# Altium schematic sheet Input.SchDoc: Inputs
size A4; Engineer: CT; SheetNumber: 5; SheetTotal: 5
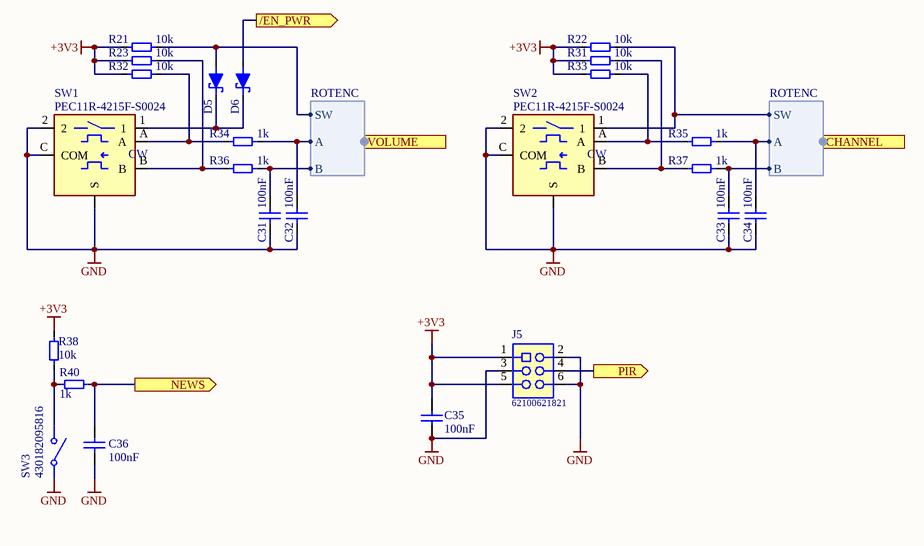
[diagram p0: Input.SchDoc]

## Parts
C31  value 100nF  [0603-C-N]  (hidden comment: Capacitor 100nF +/-10% 50V X7R 0603)
C32  value 100nF  [0603-C-N]  (hidden comment: Capacitor 100nF +/-10% 50V X7R 0603)
C33  value 100nF  [0603-C-N]  (hidden comment: Capacitor 100nF +/-10% 50V X7R 0603)
C34  value 100nF  [0603-C-N]  (hidden comment: Capacitor 100nF +/-10% 50V X7R 0603)
C35  value 100nF  [0603-C-N]  (hidden comment: Capacitor 100nF +/-10% 50V X7R 0603)
C36  value 100nF  [0603-C-N]  (hidden comment: Capacitor 100nF +/-10% 50V X7R 0603)
D5  1PS79SB30,115  [FP-SOD523-MFG]  (value not drawn)
D6  1PS79SB30,115  [FP-SOD523-MFG]  (value not drawn)
J5  62100621821  [62100621821]
R21  value 10k  [0603-R-N]  (hidden comment: Resistor 10k +/-1% 50V 0603)
R22  value 10k  [0603-R-N]  (hidden comment: Resistor 10k +/-1% 50V 0603)
R23  value 10k  [0603-R-N]  (hidden comment: Resistor 10k +/-1% 50V 0603)
R31  value 10k  [0603-R-N]  (hidden comment: Resistor 10k +/-1% 50V 0603)
R32  value 10k  [0603-R-N]  (hidden comment: Resistor 10k +/-1% 50V 0603)
R33  value 10k  [0603-R-N]  (hidden comment: Resistor 10k +/-1% 50V 0603)
R34  value 1k  [0603-R-N]  (hidden comment: Resistor 1k +/-1% 50V 0603)
R35  value 1k  [0603-R-N]  (hidden comment: Resistor 1k +/-1% 50V 0603)
R36  value 1k  [0603-R-N]  (hidden comment: Resistor 1k +/-1% 50V 0603)
R37  value 1k  [0603-R-N]  (hidden comment: Resistor 1k +/-1% 50V 0603)
R38  value 10k  [0603-R-N]  (hidden comment: Resistor 10k +/-1% 50V 0603)
R40  value 1k  [0603-R-N]  (hidden comment: Resistor 1k +/-1% 50V 0603)
SW1  PEC11R-4215F-S0024  [PEC11R-4215F-S0024]
SW2  PEC11R-4215F-S0024  [PEC11R-4215F-S0024]
SW3  430182095816  [WS-TASV_L6W6H9.5_4301x20958x6]

## Ports
/EN_PWR (out), CHANNEL (harness ROTENC), NEWS (out), PIR (out), VOLUME (harness ROTENC)

## Harnesses
ROTENC: SW, A, B

## Nets
+3V3: C35.2 J5.1 J5.5 R21.1 R22.1 R23.2 R31.2 R32.2 R33.2 R38.2
GND: C31.1 C32.1 C33.1 C34.1 C35.1 C36.1 J5.2 J5.3 J5.6 SW1.2 SW1.C(COM) SW1.S SW2.2 SW2.C(COM) SW2.S SW3.1
/EN_PWR: D6.2(A) ; port /EN_PWR
NEWS: C36.2 R40.2 ; port NEWS
PIR: J5.4 ; port PIR
NetC31_2: C31.2 R36.2 ; port VOLUME.B
NetC32_2: C32.2 R34.2 ; port VOLUME.A
NetC33_2: C33.2 R37.2 ; port CHANNEL.B
NetC34_2: C34.2 R35.2 ; port CHANNEL.A
NetD5_1: D5.1(K) D6.1(K) SW1.1
NetD5_2: D5.2(A) R21.2 ; port VOLUME.SW
NetR22_2: R22.2 SW2.1 ; port CHANNEL.SW
NetR23_1: R23.1 R36.1 SW1.B
NetR31_1: R31.1 R37.1 SW2.B
NetR32_1: R32.1 R34.1 SW1.A
NetR33_1: R33.1 R35.1 SW2.A
NetR38_1: R38.1 R40.1 SW3.2

## Notes on the sheet
- Title
- Sheet Revision:
- Link:
- Size:
- Project:
- Engineer:
- A4
- Date:
- Sheet
- of
- File:
- (in symbol CMP-011-00021-3) CW

## Library data of the parts
C31-C34 C36 = CMP-072-000620-12: WCAP-CSGP Multilayer Ceramic Chip Capacitor, General Purpose, size 0603, X7R, 100nF, 50VDC; Capacitor Type: MLCC; Tolerance: 10%; Dissipation Factor: 3%; Technical Reference: X7R0603104K050DFCT20000; Insulation Resistance: 5GO; Voltage Rating: 50V; Mounting Technology: SMT; Max Operating Temperature: 125°C; Length: 1.6mm; Case/Package: 0603; JLCPCB Part #: C14663; Min Operating Temperature: -55°C; Usage: General Purpose; Packaging: Tape and Reel; Width: 0.8mm; Height: 0.8mm; Dielectric: X7R; Pins: 2; Match Code: WCAP-CSGP; Source: WCAP-CSGP.SchLib; Design Item ID: 885012206095R; ComponentLink2Description: Datasheet Link; ComponentLink1URL: https://www.we-online.com/redexpert/article/885012206095R?ad; ComponentLink1Description: Website Link; ComponentLink2URL: https://www.we-online.com/redexpert/spec/885012206095R?ad
C35 = CMP-072-000619-13: WCAP-CSGP Multilayer Ceramic Chip Capacitor, General Purpose, size 0603, X7R, 100nF, 50VDC; Capacitor Type: MLCC; Tolerance: 10%; Dissipation Factor: 3%; Technical Reference: X7R0603104K050DFCT10000; Insulation Resistance: 5GO; Length: 1.6mm; Dielectric: X7R; Height: 0.8mm; Pins: 2; Min Operating Temperature: -55°C; Usage: General Purpose; Mounting Technology: SMT; Case/Package: 0603; Width: 0.8mm; Max Operating Temperature: 125°C; Voltage Rating: 50V; Design Item ID: 885012206095; ComponentLink1URL: https://www.we-online.com/redexpert/article/885012206095?ad; ComponentLink2URL: https://www.we-online.com/redexpert/spec/885012206095?ad; Packaging: Tape and Reel; ComponentLink1Description: Website Link; Match Code: WCAP-CSGP; ComponentLink2Description: Datasheet Link; Source: WCAP-CSGP.SchLib; JLCPCB Part #: C14663
D5 D6 = CMP-004-00048-7: VR=40V IF=200mA 20pF; Forward Voltage: 600 mV @ 200 mA; Forward Current: 200mA; Max Repetitive Reverse Voltage (Vrrm): 40V; Case/Package: SOD-523; JLCPCB Part #: C426690; RoHS Compliant: Yes
J5 = CMP-045-000366-5: WR-PHD Socket Header, SMT, pitch 2mm, Dual Row, Vertical, 6p; Manufacturer: Wurth Elektronik; Pin Number: 6; Working Voltage: 250VAC; Contact Resistance: 20mOhm; Withstanding Voltage: 500VAC; Rated Current: 2A; Orientation: Vertical; Design Item ID: 62100621821; ComponentLink2Description: Datasheet; ComponentLink1URL: http://www.we-online.de; Operating Temperature: -40 to +105degC; ComponentLink1Description: Manufacturer; Row Number: Dual; Pitch: 2mm; Component Type: Standard; Gender: Socket Header; Pin Count: 6; Mounting Technology: SMT; Packaging: Tube; Source: WR-PHD_Socket Header.SchLib; ComponentLink2URL: https://www.we-online.com/catalog/datasheet/62100621821.pdf; Manufacturer Part Number: 62100621821; JLCPCB Part #: -
R21-R23 R31-R33 R38 = CMP-009-00017-23: Chip Resistor, Thick Film, General Purpose, 0603, 100mW, 50V, 10 kOhm, +/-1%; Tolerance: 1%; Elements: 1; Power Rating: 100mW; RoHS Compliant: True; Voltage Rating: 50V; Mounting Technology: SMT; Usage: General Purpose; JLCPCB Part #: C25804; Max Operating Temperature: 155°C; Case/Package: 0603; Pins: 2; Resistor Type: Thick Film; Min Operating Temperature: -55°C
R34-R37 R40 = CMP-009-00014-24: Chip Resistor, Thick Film, General Purpose, 0603, 100mW, 50V, 1 kOhm, +/-1%; Tolerance: 1%; Elements: 1; Power Rating: 100mW; RoHS Compliant: True; Voltage Rating: 50V; Mounting Technology: SMT; Usage: General Purpose; JLCPCB Part #: C21190; Max Operating Temperature: 155°C; Case/Package: 0603; Pins: 2; Resistor Type: Thick Film; Min Operating Temperature: -55°C
SW1 SW2 = CMP-011-00021-3: Incremental Encoder 24 PPR 2 Bit Quadrature 5VDC at 10 mA IP40 PCB Mount 60RPM; pin to pad: S>S1+S2; Electrical Life Switch: 20000Cycles; Detent: Yes; Electrical Life Encoder: 15000Cycles; Insulation Resistance: 100MO; Operating Temperature Max: 85°C; Category: Encoder Switches; Component Type: Standard; Height: 13.4mm; Operating Temperature Min: -40°C; Mount: Through Hole; JLCPCB Part #: C143790
SW3 = CMP-002-000146-2: WS-TASV SMT Tact Switch, 12VDC, 50mA, 160g, height 9.5mm; pin to pad: 1>1+3 2>2+4; Manufacturer: Wurth Elektronik; Washable: No; Rated Voltage: 12V; Electrical Life: 1000000Cycles; Actuator Color: Black; Mounting Technology: SMT; Manufacturer Part Number: 430182095816; Height: 9.5mm; Component Type: Standard; Contact Plating: Silver; Design Item ID: 430182095816; ComponentLink2Description: Datasheet; ComponentLink1URL: http://www.we-online.de; Packaging: Tape and Reel; ComponentLink2URL: https://www.we-online.com/catalog/datasheet/430182095816.pdf; Width: 6mm; Operating Temperature max.: 85C; Pin Count: 4; Terminal Material: Copper Alloy; JLCPCB Part #: C285487; Length: 6mm; Operating Temperature min.: -40C; Rated Current: 50mA; Contact Material: Stainless Steel; Source: WS-TASV.SchLib; Operation Force: 160g; Terminal Plating: Silver; ComponentLink1Description: Manufacturer Link